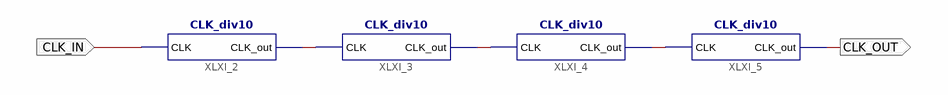
[diagram p0: schematic sheet 1]
// Xilinx ISE schematic Div_100k.sch (spartan6) as structural Verilog: 4 symbols, 2 ports
module Div_100k (
  input  CLK_IN,
  output CLK_OUT
);

  wire XLXN_2, XLXN_3, XLXN_4;

  CLK_div10 XLXI_2 (.CLK(CLK_IN), .CLK_out(XLXN_2));
  CLK_div10 XLXI_3 (.CLK(XLXN_2), .CLK_out(XLXN_3));
  CLK_div10 XLXI_4 (.CLK(XLXN_3), .CLK_out(XLXN_4));
  CLK_div10 XLXI_5 (.CLK(XLXN_4), .CLK_out(CLK_OUT));
endmodule
